# Altium project BuckBoost.PrjPCB
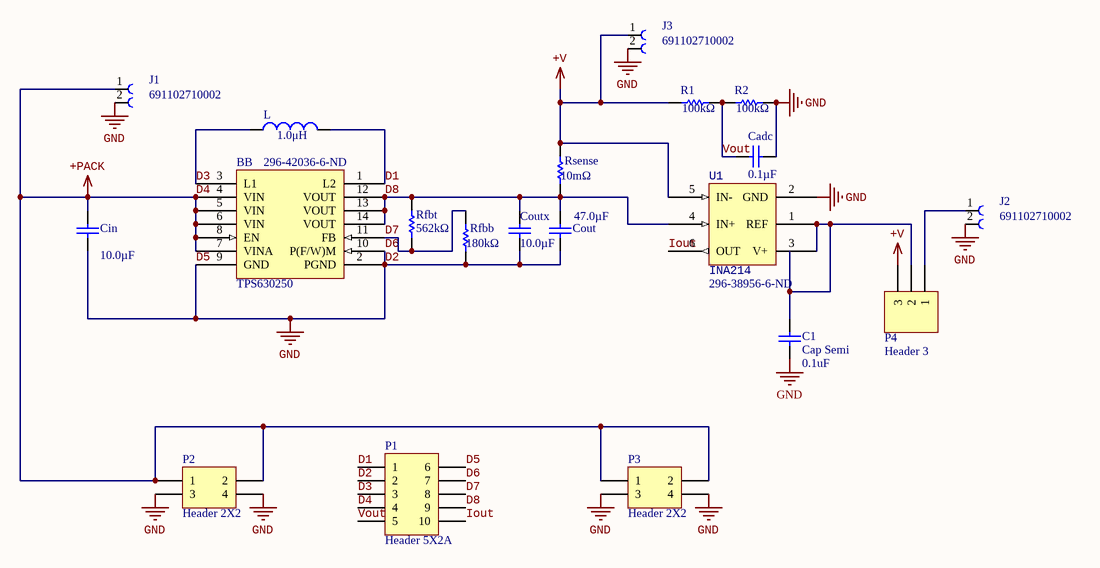
[diagram p0: buckboost.SchDoc]
1 sheet, 20 parts. Net scope: global (net labels, ports and power ports of the same name join across sheets).
Board file: buckboost.PcbDoc

## Sheet buckboost.SchDoc
size A4

### Parts
BB  TPS630250  Supplier Part Number 1: 296-42036-6-ND  [RNC0014A]
C1  Cap Semi  value 0.1uF  [0603]
Cadc  value 0.1µF  [0603]  (hidden comment: Cap)
Cin  value 10.0µF  [0603]  (hidden comment: Cap)
Cout  value 47.0µF  [1206]  (hidden comment: Cap)
Coutx  value 10.0µF  [0603]  (hidden comment: Cap)
J1  691102710002  [691102710002]
J2  691102710002  [691102710002]
J3  691102710002  [691102710002]
L  value 1.0μH  [IHLP-1212BZ]  (hidden comment: Inductor)
P1  Header 5X2A  [HDR2X5_CEN]
P2  Header 2X2  [HDR2X2]
P3  Header 2X2  [HDR2X2]
P4  Header 3  [HDR1X3]
R1  value 100kΩ  [0603]  (hidden comment: Res1)
R2  value 100kΩ  [0603]  (hidden comment: Res1)
Rfbb  value 180kΩ  [0603]  (hidden comment: Res1)
Rfbt  value 562kΩ  [0603]  (hidden comment: Rfbt)
Rsense  value 10mΩ  [0603]  (hidden comment: Rsense)
U1  INA214  Supplier Part Number 1: 296-38956-6-ND  [SOT65P210X110-6N]

### Nets
+V: J3.1 P4.3 R1.1 Rsense.2 U1.5(IN-)
D2: BB.2(PGND) BB.9(GND) BB.10(P(F/W)M) C1.1 Cadc.1 Cin.1 Cout.1 Coutx.1 J1.2 J2.2 J3.2 P1.2 P1.6 P1.7 P2.3 P2.4 P3.3 P3.4 R2.2 Rfbb.1 U1.2(GND)  [also labelled D5, D6, GND]
D4: BB.4(VIN) BB.5(VIN) BB.6(VIN) BB.7(VINA) BB.8(EN) Cin.2 J1.1 P1.4 P2.1 P2.2 P3.1 P3.2  [also labelled +PACK]
D1: BB.1(L2) L.2 P1.1
D3: BB.3(L1) L.1 P1.3
D7: BB.11(FB) P1.8 Rfbb.2 Rfbt.2
D8: BB.12(VOUT) BB.13(VOUT) BB.14(VOUT) Cout.2 Coutx.2 P1.9 Rfbt.1 Rsense.1 U1.4(IN+)
Iout: P1.10 U1.6(OUT)
Vout: Cadc.2 P1.5 R1.2 R2.1
NetC1_2: C1.2 P4.2 U1.1(REF) U1.3(V+)
NetJ2_1: J2.1 P4.1

### Library data of the parts
BB = TPS630250: Buck-boost converter; Supplier 1: Digi-Key
C1 = Cap Semi: Capacitor (Semiconductor SIM Model); Published: 8-Jun-2000; LatestRevisionDate: 29-May-2009; LatestRevisionNote: IPC-7351 Footprint Added.; PackageReference: C1206; Publisher: Altium Limited; PackageDescription: Chip Capacitor
Cadc Cin Cout Coutx = Cap: Capacitor; Published: 8-Jun-2000; LatestRevisionDate: 17-Jul-2002; LatestRevisionNote: Re-released for DXP Platform.; PackageReference: RAD-0.3; Publisher: Altium Limited; PackageDescription: Radial Cap, Thru-Hole; 2 Leads; 0.3 in Pin Spacing
J1-J3 = 691102710002: 102 Series 5mm Pitch Straight, PCB Terminal Block, Through Hole, 2 Way; MF: Wurth Electronics; Price: None; Package: None; SnapEDA_Link: https://www.snapeda.com/parts/691102710002/Wurth%20Electronics%20Inc/view-part/?ref=snap; MP: 691102710002; Availability: Unavailable; Value: *
L = Inductor: Code_IEC: 1005; Published: 8-Jun-2000; LatestRevisionDate: 29-May-2009; LatestRevisionNote: IPC-7351 Footprint Added.; PackageReference: 0402-A; Publisher: Altium Limited; PackageDescription: Chip Inductor; Code_JEITA: 0402
P1 = Header 5X2A: Header, 5-Pin, Dual row; LatestRevisionDate: 17-Jul-2002; LatestRevisionNote: Re-released for DXP Platform.; Publisher: Altium Limited
P2 P3 = Header 2X2: Header, 2-Pin, Dual row; LatestRevisionDate: 17-Jul-2002; LatestRevisionNote: Re-released for DXP Platform.; Publisher: Altium Limited
P4 = Header 3: Header, 3-Pin; LatestRevisionDate: 17-Jul-2002; LatestRevisionNote: Re-released for DXP Platform.; Publisher: Altium Limited
R1 R2 Rfbb Rfbt Rsense = Res1: Resistor; Published: 8-Jun-2000; LatestRevisionDate: 17-Jul-2002; LatestRevisionNote: Re-released for DXP Platform.; PackageReference: AXIAL-0.3; Publisher: Altium Limited; PackageDescription: Axial Device, Thru-Hole; 2 Leads; 0.3 in Pin Spacing
U1 = INA214: Current monitor; Supplier 1: Digi-Key